# Altium schematic sheet Hardwiring.SchDoc
size 594 x 420 mm; Address1: Address1; Address2: Address2; Address3: Address3; Address4: Address4; DocumentNumber: *Э3; SheetNumber: 10; SheetTotal: 10; DocumentType: Схема электрическая *
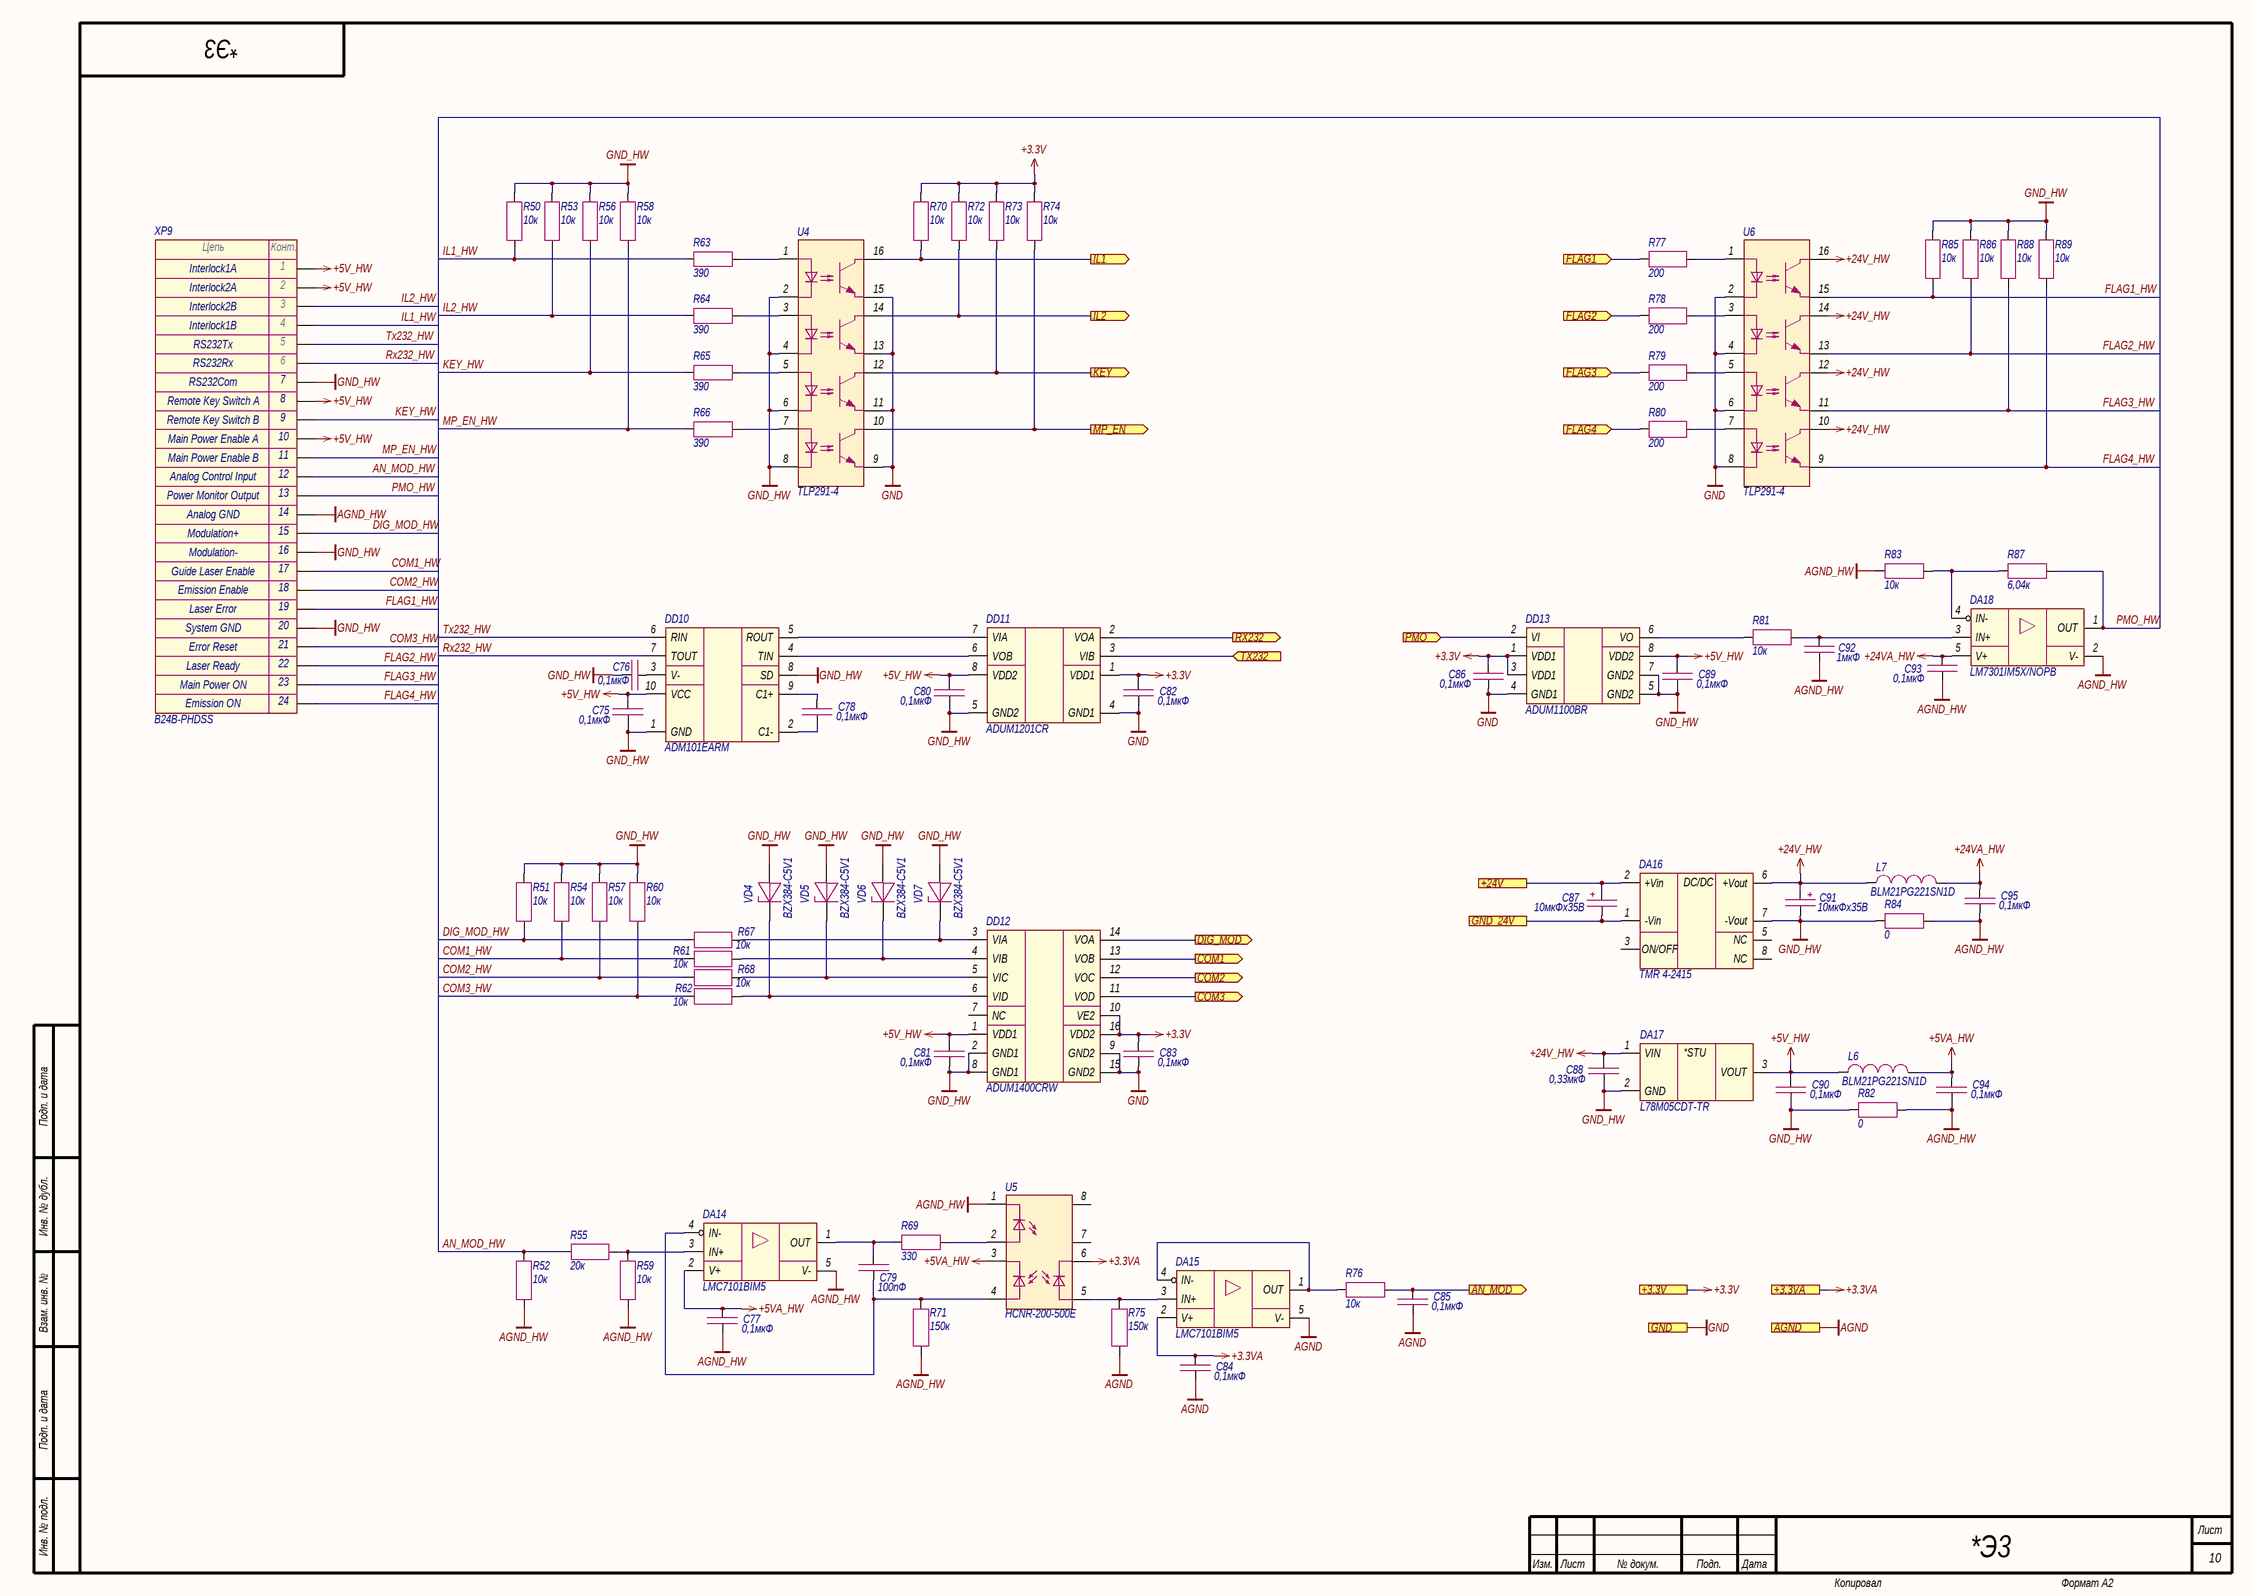
[diagram p0: Hardwiring.SchDoc]

## Parts
C75  0,1мкФ  [CAP_0603]
C76  0,1мкФ  [CAP_0603]
C77  0,1мкФ  [CAP_0603]
C78  0,1мкФ  [CAP_0603]
C79  100пФ  [CAP_0603]
C80  0,1мкФ  [CAP_0603]
C81  0,1мкФ  [CAP_0603]
C82  0,1мкФ  [CAP_0603]
C83  0,1мкФ  [CAP_0603]
C84  0,1мкФ  [CAP_0603]
C85  0,1мкФ  [CAP_0603]
C86  0,1мкФ  [CAP_0603]
C87  10мкФх35B  [CAP_C]
C88  0,33мкФ  [CAP_0805]
C89  0,1мкФ  [CAP_0603]
C90  0,1мкФ  [CAP_0603]
C91  10мкФх35B  [CAP_C]
C92  1мкФ  [CAP_0603]
C93  0,1мкФ  [CAP_0603]
C94  0,1мкФ  [CAP_0603]
C95  0,1мкФ  [CAP_0603]
DA14  LMC7101BIM5  [SOT-23-5]
DA15  LMC7101BIM5  [SOT-23-5]
DA16  TMR 4-2415  [TMR4 (SIP-8)]
DA17  L78M05CDT-TR  [TO-252]
DA18  LM7301IM5X/NOPB  [SOT-23-5]
DD10  ADM101EARM  [MSOP-10]
DD11  ADUM1201CR  [SOIC-8]
DD12  ADUM1400CRW  [SOIC-16W]
DD13  ADUM1100BR  [SOIC-8]
L6  BLM21PG221SN1D  [IND_0805]
L7  BLM21PG221SN1D  [IND_0805]
R50  10к  [RES_0603]
R51  10к  [RES_0603]
R52  10к  [RES_0603]
R53  10к  [RES_0603]
R54  10к  [RES_0603]
R55  20к  [RES_0603]
R56  10к  [RES_0603]
R57  10к  [RES_0603]
R58  10к  [RES_0603]
R59  10к  [RES_0603]
R60  10к  [RES_0603]
R61  10к  [RES_0603]
R62  10к  [RES_0603]
R63  390  [RES_0603]
R64  390  [RES_0603]
R65  390  [RES_0603]
R66  390  [RES_0603]
R67  10к  [RES_0603]
R68  10к  [RES_0603]
R69  330  [RES_0603]
R70  10к  [RES_0603]
R71  150к  [RES_0603]
R72  10к  [RES_0603]
R73  10к  [RES_0603]
R74  10к  [RES_0603]
R75  150к  [RES_0603]
R76  10к  [RES_0603]
R77  200  [RES_0603]
R78  200  [RES_0603]
R79  200  [RES_0603]
R80  200  [RES_0603]
R81  10к  [RES_0603]
R82  0  [RES_0805]
R83  10к  [RES_0603]
R84  0  [RES_0805]
R85  10к  [RES_0603]
R86  10к  [RES_0603]
R87  6,04к  [RES_0603]
R88  10к  [RES_0603]
R89  10к  [RES_0603]
U4  TLP291-4  [SOP-16]
U5  HCNR-200-500E  [HCNR200]
U6  TLP291-4  [SOP-16]
VD4  BZX384-C5V1  [SOD-323]
VD5  BZX384-C5V1  [SOD-323]
VD6  BZX384-C5V1  [SOD-323]
VD7  BZX384-C5V1  [SOD-323]
XP9  B24B-PHDSS  [B24B-PHDSS]

## Ports
+3.3V (see Main[2C], Ethernet[3D], Fiber_interlock[2C], LD_driver[1D], Power_supply[1D]), +3.3VA (see Main[2C], Photodiode[1C], Thermistor[2C]), +24V (see Main[2C], Indication[1C], LD_driver[1C], Power_supply[1D]), AGND (see Main[2C], Photodiode[1C], Thermistor[2C]), AN_MOD (out, see Main[2C]), COM1 (out, see Main[2C]), COM2 (out, see Main[2C]), COM3 (out, see Main[2C]), DIG_MOD (out, see Main[2C]), FLAG1 (in, see Main[2B]), FLAG2 (in, see Main[2B]), FLAG3 (in, see Main[2C]), FLAG4 (in, see Main[2C]), GND (see Main[2C], Ethernet[3D], Fiber_interlock[2C], Guide_laser[1C], Indication[1C], LD_driver[1D], Power_supply[1D]), GND_24V (see Main[2C], Indication[1C], LD_driver[1D], Power_supply[1D]), IL1 (out, see Main[2B]), IL2 (out, see Main[2B]), KEY (out, see Main[2C]), MP_EN (out, see Main[2C]), PMO (in, see Main[2C]), RX232 (out, see Main[2C]), TX232 (in, see Main[2C])

## Nets
+3.3V: C82.1 C83.1 C86.1 DD11.1(VDD1) DD12.10(VE2) DD12.16(VDD2) DD13.1(VDD1) DD13.3(VDD1) R70.1 R72.1 R73.1 R74.1 ; port +3.3V
+3.3VA: C84.1 DA15.2(V+) U5.6 ; port +3.3VA
+5V_HW: C75.1 C80.1 C81.1 C89.1 C90.1 DA17.3(VOUT) DD10.10(VCC) DD11.8(VDD2) DD12.1(VDD1) DD13.8(VDD2) L6.1 XP9.1 XP9.2 XP9.8 XP9.10
+5VA_HW: C77.1 C94.1 DA14.2(V+) L6.2 U5.3
+24V_HW: C88.2 C91.1 DA16.6(+Vout) DA17.1(VIN) L7.1 U6.10 U6.12 U6.14 U6.16
+24VA_HW: C93.1 C95.1 DA18.5(V+) L7.2
AGND: C84.2 C85.2 DA15.5(V-) R75.2 ; port AGND
AGND_HW: C77.2 C92.2 C93.2 C94.2 C95.2 DA14.5(V-) DA18.2(V-) R52.2 R59.2 R71.2 R82.2 R83.1 R84.2 U5.1 XP9.14
GND: C82.2 C83.2 C86.2 DD11.4(GND1) DD12.9(GND2) DD12.15(GND2) DD13.4(GND1) U4.9 U4.11 U4.13 U4.15 U6.2 U6.4 U6.6 U6.8 ; port GND
GND_HW: C75.2 C76.2 C80.2 C81.2 C88.1 C89.2 C90.2 C91.2 DA16.7(-Vout) DA17.2(GND) DD10.1(GND) DD10.8(SD) DD11.5(GND2) DD12.2(GND1) DD12.8(GND1) DD13.5(GND2) DD13.7(GND2) R50.1 R51.1 R53.1 R54.1 R56.1 R57.1 R58.1 R60.1 R82.1 R84.1 R85.1 R86.1 R88.1 R89.1 U4.2 U4.4 U4.6 U4.8 VD4.2(A) VD5.2(A) VD6.2(A) VD7.2(A) XP9.7 XP9.16 XP9.20
+24V: C87.1 DA16.2(+Vin) ; port +24V
AN_MOD: C85.1 R76.2 ; port AN_MOD
AN_MOD_HW: R52.1 R55.1 XP9.12
COM1: DD12.13(VOB) ; port COM1
COM1_HW: R54.2 R61.1 XP9.17
COM2: DD12.12(VOC) ; port COM2
COM2_HW: R57.2 R68.1 XP9.18
COM3: DD12.11(VOD) ; port COM3
COM3_HW: R60.2 R62.1 XP9.21
DIG_MOD: DD12.14(VOA) ; port DIG_MOD
DIG_MOD_HW: R51.2 R67.1 XP9.15
FLAG1: R77.2 ; port FLAG1
FLAG1_HW: R85.2 U6.15 XP9.19
FLAG2: R78.2 ; port FLAG2
FLAG2_HW: R86.2 U6.13 XP9.22
FLAG3: R79.2 ; port FLAG3
FLAG3_HW: R88.2 U6.11 XP9.23
FLAG4: R80.2 ; port FLAG4
FLAG4_HW: R89.2 U6.9 XP9.24
GND_24V: C87.2 DA16.1(-Vin) ; port GND_24V
IL1: R70.2 U4.16 ; port IL1
IL1_HW: R50.2 R63.1 XP9.4
IL2: R72.2 U4.14 ; port IL2
IL2_HW: R53.2 R64.1 XP9.3
KEY: R73.2 U4.12 ; port KEY
KEY_HW: R56.2 R65.1 XP9.9
MP_EN: R74.2 U4.10 ; port MP_EN
MP_EN_HW: R58.2 R66.1 XP9.11
PMO: DD13.2(VI) ; port PMO
PMO_HW: DA18.1(OUT) R87.2 XP9.13
RX232: DD11.2(VOA) ; port RX232
Rx232_HW: DD10.7(TOUT) XP9.6
TX232: DD11.3(VIB) ; port TX232
Tx232_HW: DD10.6(RIN) XP9.5
NetC76_1: C76.1 DD10.3(V-)
NetC78_1: C78.1 DD10.9(C1+)
NetC78_2: C78.2 DD10.2(C1-)
NetC79_1: C79.1 DA14.1(OUT) R69.1
NetC79_2: C79.2 DA14.4(IN-) R71.1 U5.4
NetC92_1: C92.1 DA18.3(IN+) R81.2
NetDA14_3: DA14.3(IN+) R55.2 R59.1
NetDA15_1: DA15.1(OUT) DA15.4(IN-) R76.1
NetDA15_3: DA15.3(IN+) R75.1 U5.5
NetDA18_4: DA18.4(IN-) R83.2 R87.1
NetDD10_4: DD10.4(TIN) DD11.6(VOB)
NetDD10_5: DD10.5(ROUT) DD11.7(VIA)
NetDD12_3: DD12.3(VIA) R67.2 VD7.1(K)
NetDD12_4: DD12.4(VIB) R61.2 VD6.1(K)
NetDD12_5: DD12.5(VIC) R68.2 VD5.1(K)
NetDD12_6: DD12.6(VID) R62.2 VD4.1(K)
NetDD13_6: DD13.6(VO) R81.1
NetR63_2: R63.2 U4.1
NetR64_2: R64.2 U4.3
NetR65_2: R65.2 U4.5
NetR66_2: R66.2 U4.7
NetR69_2: R69.2 U5.2
NetR77_1: R77.1 U6.1
NetR78_1: R78.1 U6.3
NetR79_1: R79.1 U6.5
NetR80_1: R80.1 U6.7

Not connected (* = marked no-connect by the designer): DA16 3(ON/OFF) 5(NC) 8(NC); DD12 7(NC); U5 7 8

## Notes on the sheet
- Interlock1A
- Interlock2A
- Interlock2B
- Interlock1B
- RS232Tx
- RS232Rx
- RS232Com
- (near XP9) Remote Key Switch A
- (near XP9) Remote Key Switch B
- (near XP9) Main Power Enable A
- (near XP9) Main Power Enable B
- (near XP9) Analog Control Input
- (near XP9) Power Monitor Output
- Analog GND
- Modulation+
- Modulation-
- (near XP9) Guide Laser Enable
- (near XP9) Emission Enable
- System GND
- Error Reset
- Laser Error
- Main Power ON
- Emission ON
- Laser Ready
- Подп. и дата
- Инв. № дубл.
- Взам. инв. №
- Инв. № подл.
- Изм.
- Лист
- № докум.
- Подп.
- Дата
- Копировал
- Формат А2
- (in symbol Connector-24) Цепь; Конт.
- (in symbol L78M) *STU
- (in symbol TMR4) DC/DC

## Library data of the parts
C75-C78 C80-C86 C89 C90 C93-C95 = Capacitor: Manufacturer: Murata; Model: GRM188R71H104KA93D; Value: 0,1мкФ; Document: *
C79 = Capacitor: Manufacturer: Murata; Model: GRM1885C1H101JA01D; Value: 100пФ; Document: *
C87 C91 = Capacitor_Polar: Model: TECAP, 10 мкФ, 35 В, тип C, 10%; Value: 10мкФх35B; Document: *; Manufacturer: *
C88 = Capacitor: Manufacturer: Murata; Model: GRM219R71H334KA88D; Value: 0,33мкФ; Document: *
C92 = Capacitor: Manufacturer: Murata; Model: GRM188R61H105KAALD; Value: 1мкФ; Document: *
DA14 DA15 = LMC7101: Manufacturer: Texas Instruments; Model: LMC7101BIM5; Document: *
DA16 = TMR4: Manufacturer: Traco Power; Model: TMR 4-2415; Document: *
DA17 = L78M: Manufacturer: STMicroelectronics; Model: L78M05CDT-TR; Document: *
DA18 = LM7301IM5: Manufacturer: Texas Instruments; Model: LM7301IM5X/NOPB; Document: *
DD10 = ADM101EARM: Manufacturer: Analog Devices; Model: ADM101EARM; Document: *
DD11 = ADUM1201: Manufacturer: Analog Devices; Model: ADUM1201CR; Document: *
DD12 = ADUM1400: Manufacturer: Analog Devices; Model: ADUM1400CRW; Document: *
DD13 = ADUM1100: Manufacturer: Analog Devices; Model: ADUM1100BR; Document: *
L6 L7 = Inductor: Manufacturer: Murata; Value: *; Model: BLM21PG221SN1D; Document: *
R50-R54 R56-R62 R67 R68 R70 R72-R74 R76 R81 R83 R85 R86 R88 R89 = Resistor: Manufacturer: Yageo; Model: RC0603FR-0710KL; Value: 10к; Document: *
R55 = Resistor: Manufacturer: Yageo; Model: RC0603FR-0720KL; Value: 20к; Document: *
R63-R66 = Resistor: Manufacturer: Yageo; Model: RC0603FR-07390RL; Value: 390; Document: *
R69 = Resistor: Manufacturer: Yageo; Model: RC0603FR-07330RL; Value: 330; Document: *
R71 R75 = Resistor: Manufacturer: Yageo; Model: RC0603FR-07150KL; Value: 150к; Document: *
R77-R80 = Resistor: Manufacturer: Yageo; Model: RC0603FR-07200RL; Value: 200; Document: *
R82 R84 = Resistor: Manufacturer: Yageo; Model: RC0805FR-070RL; Value: 0; Document: *
R87 = Resistor: Manufacturer: Yageo; Model: RC0603FR-076K04L; Value: 6,04к; Document: *
U4 U6 = TLP281-4: Manufacturer: Toshiba; Model: TLP291-4; Document: *
U5 = HCNR200: Manufacturer: Avago; Model: HCNR-200-500E; Document: *
VD4-VD7 = Diode_Zener: Manufacturer: Nexperia; Model: BZX384-C5V1; Document: *
XP9 = Connector-24: Manufacturer: JST; Model: B24B-PHDSS; Document: *